# Altium project LimeSDR_Mini_1v0.PrjPcb (part 3 of 3)

## Sheet 09_Misc.SchDoc: Misc
size A3; Organization: Lime Microsystems; Address1: Surrey Tech Centre; Address2: Guildford GU2 7YG; Address3: Surrey; Address4: United Kingdom; Revision: v1.0; SheetNumber: 9; SheetTotal: 9
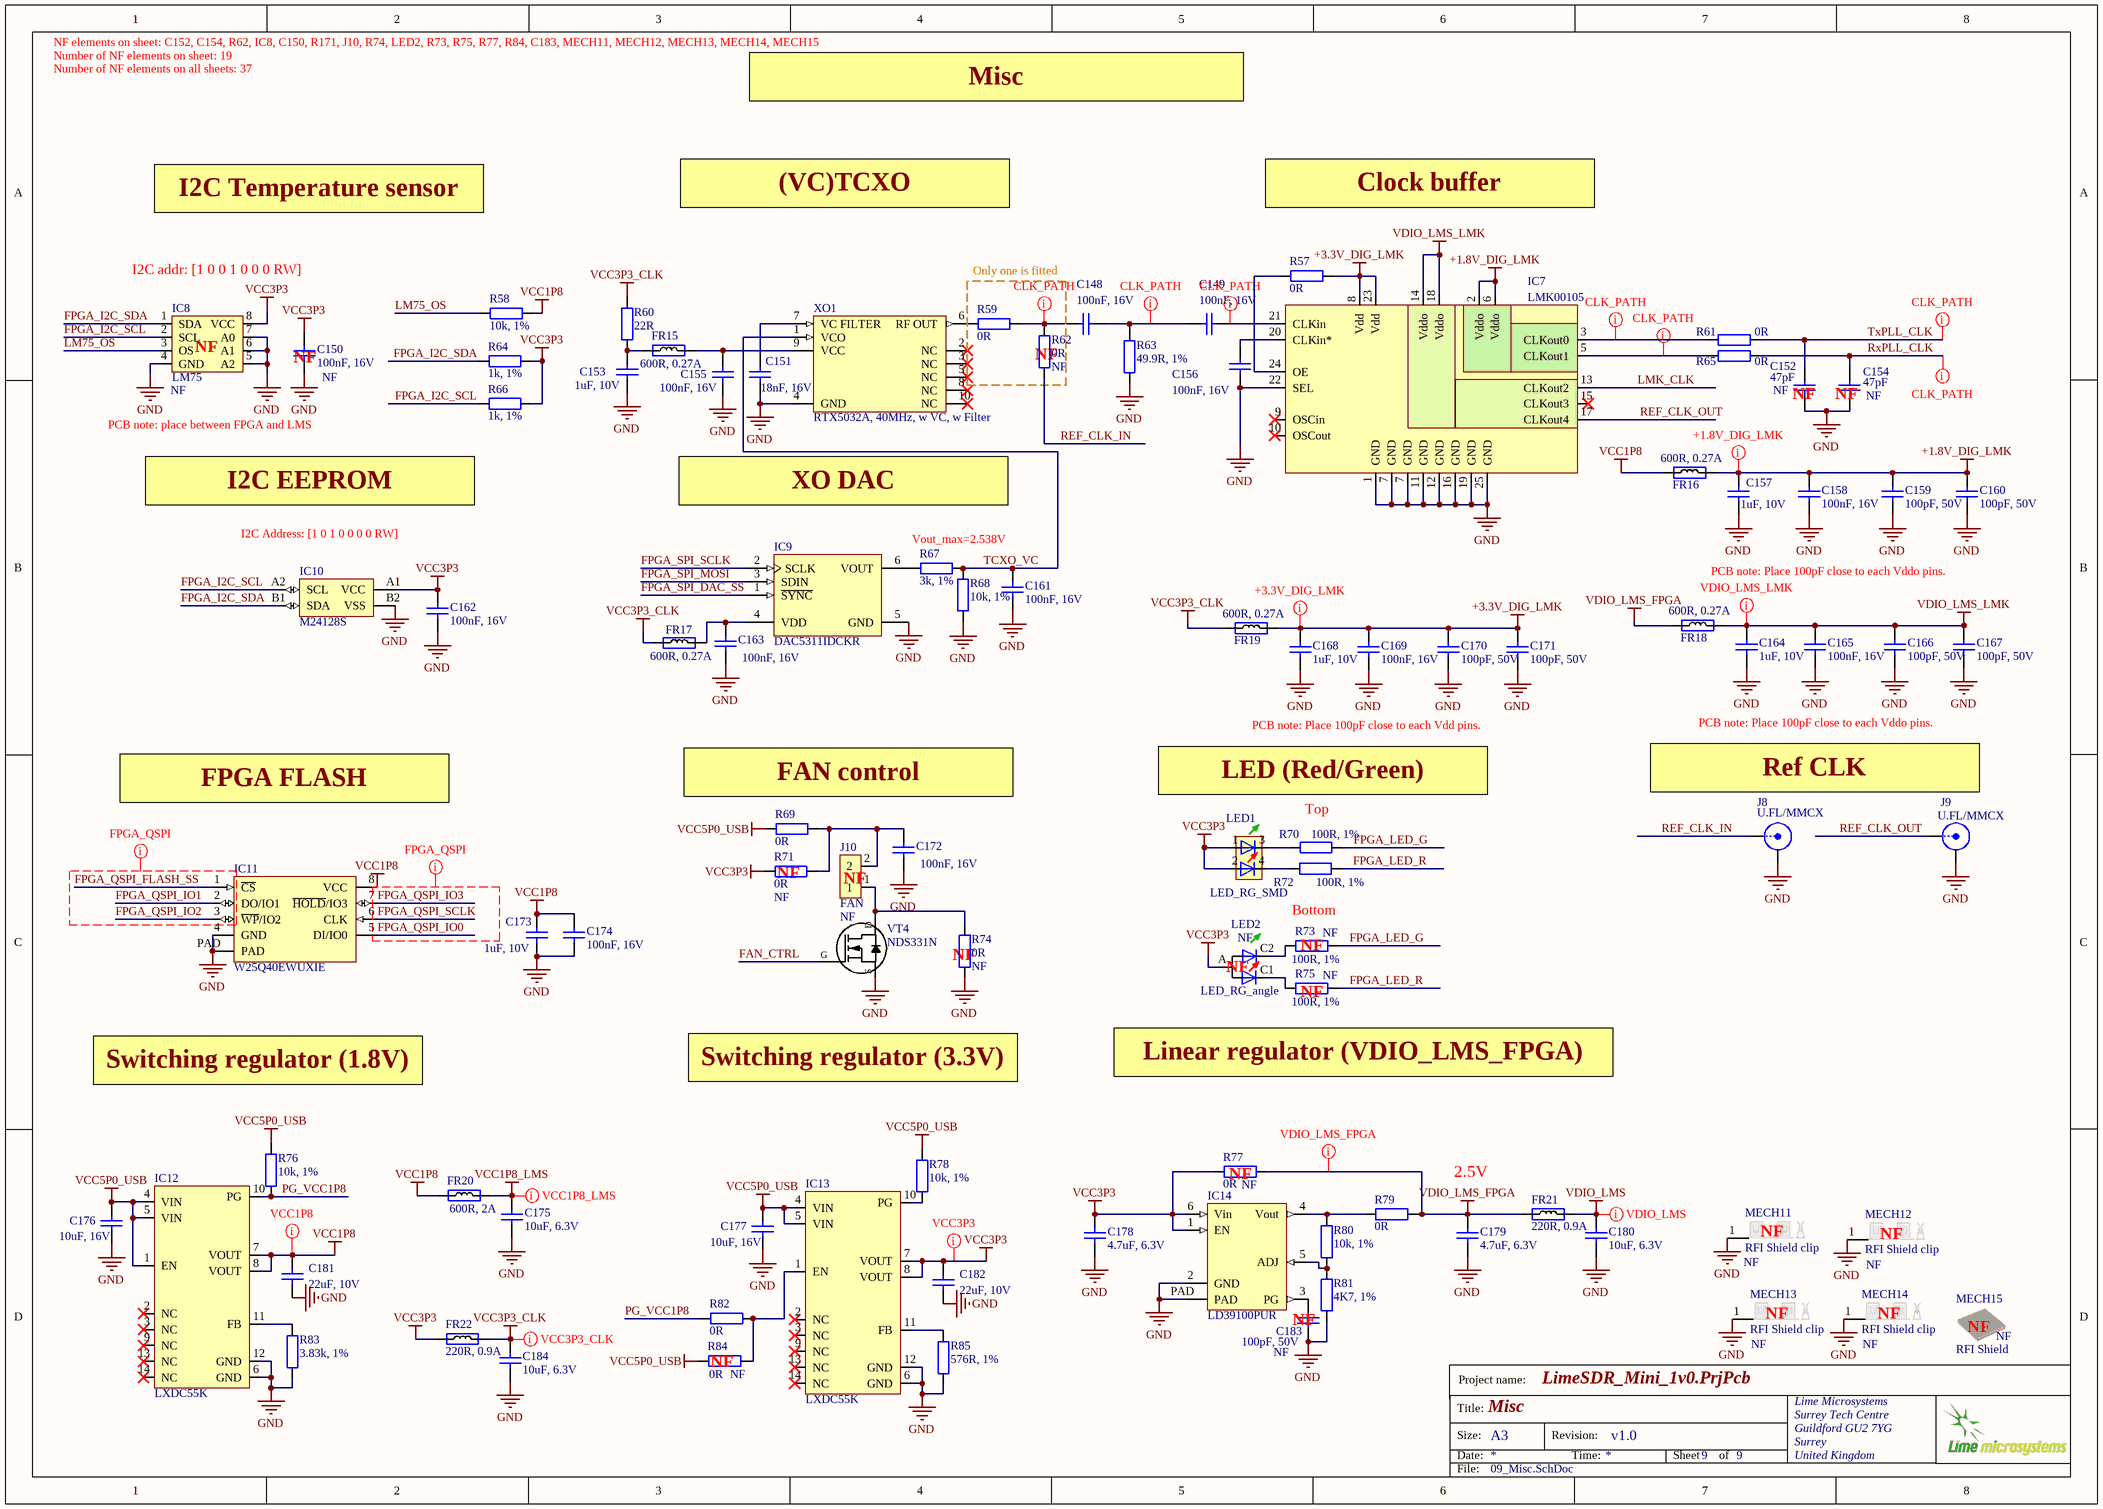
[diagram p6: 09_Misc.SchDoc]

### Parts
C148  100nF, 16V  [CAP0402]
C149  100nF, 16V  [CAP0402]
C150  100nF, 16V  Assembly Info: NF  [CAP0402]
C151  18nF, 16V  [CAP0402]
C152  47pF  Assembly Info: NF  [CAP0402]
C153  1uF, 10V  [CAP0402]
C154  47pF  Assembly Info: NF  [CAP0402]
C155  100nF, 16V  [CAP0402]
C156  100nF, 16V  [CAP0402]
C157  1uF, 10V  [CAP0402]
C158  100nF, 16V  [CAP0402]
C159  100pF, 50V  [CAP0402]
C160  100pF, 50V  [CAP0402]
C161  100nF, 16V  [CAP0402]
C162  100nF, 16V  [CAP0402]
C163  100nF, 16V  [CAP0402]
C164  1uF, 10V  [CAP0402]
C165  100nF, 16V  [CAP0402]
C166  100pF, 50V  [CAP0402]
C167  100pF, 50V  [CAP0402]
C168  1uF, 10V  [CAP0402]
C169  100nF, 16V  [CAP0402]
C170  100pF, 50V  [CAP0402]
C171  100pF, 50V  [CAP0402]
C172  100nF, 16V  [CAP0402]
C173  1uF, 10V  [CAP0402]
C174  100nF, 16V  [CAP0402]
C175  10uF, 6.3V  [CAP0603]
C176  10uF, 16V  [CAP0603]
C177  10uF, 16V  [CAP0603]
C178  4.7uF, 6.3V  [CAP0402]
C179  4.7uF, 6.3V  [CAP0402]
C180  10uF, 6.3V  [CAP0603]
C181  22uF, 10V  [CAP0603]
C182  22uF, 10V  [CAP0603]
C183  100pF, 50V  Assembly Info: NF  [CAP0402]
C184  10uF, 6.3V  [CAP0603]
FR15  600R, 0.27A  [RES0201]
FR16  600R, 0.27A  [RES0201]
FR17  600R, 0.27A  [RES0201]
FR18  600R, 0.27A  [RES0201]
FR19  600R, 0.27A  [RES0201]
FR20  600R, 2A  [RES0805]
FR21  220R, 0.9A  [RES0402]
FR22  220R, 0.9A  [RES0402]
IC7  LMK00105  [LMK00105SQ]
IC8  LM75  Assembly Info: NF  [HWSON8_LM75]
IC9  DAC5311IDCKR  [AD5601_SOT23-6]
IC10  M24128S  [M24128S]
IC11  W25Q40EWUXIE  [W25Q40EWUXIE_8-USON]
IC12  LXDC55K  [LXDC55K]
IC13  LXDC55K  [LXDC55K]
IC14  LD39100PUR  [LD39100PUR]
J8  U.FL/MMCX  [MMCX_UFL_conn_u]
J9  U.FL/MMCX  [MMCX_UFL_conn_u]
J10  FAN  Assembly Info: NF  [HDR_1x2_v2]
LED1  LED_RG_SMD  [LED-2x0603]
LED2  LED_RG_angle  Assembly Info: NF  [LED_RG_RIGHT_ANGLE_v2]
MECH11  RFI Shield clip  Assembly Info: NF  [RFI_SHIELD_CLPS_MINI]
MECH12  RFI Shield clip  Assembly Info: NF  [RFI_SHIELD_CLPS_MINI]
MECH13  RFI Shield clip  Assembly Info: NF  [RFI_SHIELD_CLPS_MINI]
MECH14  RFI Shield clip  Assembly Info: NF  [RFI_SHIELD_CLPS_MINI]
MECH15  RFI Shield  Assembly Info: NF  [WurthElectronic_RF_shield]
R57  0R  [RES0402]
R58  10k, 1%  [RES0402]
R59  0R  [RES0402]
R60  22R  [RES0402]
R61  0R  [RES0402]
R62  0R  Assembly Info: NF  [RES0402]
R63  49.9R, 1%  [RES0402]
R64  1k, 1%  [RES0402]
R65  0R  [RES0402]
R66  1k, 1%  [RES0402]
R67  3k, 1%  [RES0402]
R68  10k, 1%  [RES0402]
R69  0R  [RES0402]
R70  100R, 1%  [RES0402]
R71  0R  Assembly Info: NF  [RES0402]
R72  100R, 1%  [RES0402]
R73  100R, 1%  Assembly Info: NF  [RES0402]
R74  0R  Assembly Info: NF  [RES0402]
R75  100R, 1%  Assembly Info: NF  [RES0402]
R76  10k, 1%  [RES0402]
R77  0R  Assembly Info: NF  [RES0402]
R78  10k, 1%  [RES0402]
R79  0R  [RES0402]
R80  10k, 1%  [RES0402]
R81  4K7, 1%  [RES0402]
R82  0R  [RES0402]
R83  3.83k, 1%  [RES0402]
R84  0R  Assembly Info: NF  [RES0402]
R85  576R, 1%  [RES0402]
VT4  NDS331N  [SOT23-3]
XO1  RTX5032A, 40MHz, w VC, w Filter  [RAKON_RTX5032A]

### Blocks framed on the sheet
Only one is fitted: R59 R62

### Nets
+1.8V_DIG_LMK: C157.2 C158.2 C159.2 C160.2 FR16.2 IC7.2(Vddo) IC7.6(Vddo)
+3.3V_DIG_LMK: C168.2 C169.2 C170.2 C171.2 FR19.2 IC7.8(Vdd) IC7.23(Vdd) R57.2
GND: C150.2 C151.1 C152.1 C153.1 C154.1 C155.1 C156.1 C157.1 C158.1 C159.1 C160.1 C161.1 C162.2 C163.2 C164.1 C165.1 C166.1 C167.1 C168.1 C169.1 C170.1 C171.1 C172.2 C173.1 C174.2 C175.1 C176.1 C177.1 C178.1 C179.1 C180.1 C181.1 C182.1 C183.1 C184.1 IC7.1(GND) IC7.7(GND) IC7.11(GND) IC7.12(GND) IC7.16(GND) IC7.19(GND) IC7.22(SEL) IC7.25(GND) IC8.4(GND) IC8.5(A2) IC8.6(A1) IC8.7(A0) IC9.5(GND) IC10.B2(VSS) IC11.4(GND) IC11.PAD IC12.6(GND) IC12.12(GND) IC13.6(GND) IC13.12(GND) IC14.2(GND) IC14.PAD J8.2(Y) J9.2(Y) MECH11.1(GND) MECH12.1(GND) MECH13.1(GND) MECH14.1(GND) R63.1 R68.2 R74.1 R81.2 R83.1 R85.1 VT4.S XO1.4(GND)
VCC1P8: C173.2 C174.1 C181.2 FR16.1 FR20.1 IC11.8(VCC) IC12.7(VOUT) IC12.8(VOUT) R58.2
VCC1P8_LMS: C175.2 FR20.2
VCC3P3: C150.1 C162.1 C178.2 C182.2 FR22.1 IC8.8(VCC) IC10.A1(VCC) IC13.7(VOUT) IC13.8(VOUT) IC14.1(EN) IC14.6(Vin) LED1.1 LED1.2 LED2.A R64.1 R66.1 R71.1 R77.1
VCC3P3_CLK: C184.2 FR17.1 FR19.1 FR22.2 R60.2
VCC5P0_USB: C176.2 C177.2 IC12.1(EN) IC12.4(VIN) IC12.5(VIN) IC13.4(VIN) IC13.5(VIN) R69.1 R76.2 R78.2 R84.1
VDIO_LMS: C180.2 FR21.2
VDIO_LMS_FPGA: C179.2 FR18.1 FR21.1 R77.2 R79.2
VDIO_LMS_LMK: C164.2 C165.2 C166.2 C167.2 FR18.2 IC7.14(Vddo) IC7.18(Vddo)
FAN_CTRL: VT4.G
FPGA_I2C_SCL: IC8.2(SCL) IC10.A2(SCL) R66.2
FPGA_I2C_SDA: IC8.1(SDA) IC10.B1(SDA) R64.2
FPGA_LED_G: R70.2 R73.2
FPGA_LED_R: R72.2 R75.2
FPGA_QSPI_FLASH_SS: IC11.1(~{CS})
FPGA_QSPI_IO0: IC11.5(DI/IO0)
FPGA_QSPI_IO1: IC11.2(DO/IO1)
FPGA_QSPI_IO2: IC11.3(~{WP}/IO2)
FPGA_QSPI_IO3: IC11.7(~{HOLD}/IO3)
FPGA_QSPI_SCLK: IC11.6(CLK)
FPGA_SPI_DAC_SS: IC9.1(~{SYNC})
FPGA_SPI_MOSI: IC9.3(SDIN)
FPGA_SPI_SCLK: IC9.2(SCLK)
LM75_OS: IC8.3(OS) R58.1
LMK_CLK: IC7.13(CLKout2)
PG_VCC1P8: IC12.10(PG) R76.1 R82.2
REF_CLK_IN: J8.1(X) R62.1
REF_CLK_OUT: IC7.17(CLKout4) J9.1(X)
RxPLL_CLK: C154.2 R65.1
TCXO_VC: C161.2 R67.1 R68.1 XO1.1(VCO)
TxPLL_CLK: C152.2 R61.1
NetC148_1: C148.1 C149.2 R63.2
NetC148_2: C148.2 R59.2 R62.2
NetC149_1: C149.1 IC7.21(CLKin)
NetC151_2: C151.2 XO1.7(VC_FILTER)
NetC153_2: C153.2 FR15.1 R60.1
NetC155_2: C155.2 FR15.2 XO1.9(VCC)
NetC156_2: C156.2 IC7.20(CLKin*)
NetC163_1: C163.1 FR17.2 IC9.4(VDD)
NetC172_1: C172.1 J10.2 R69.2 R71.2
NetC183_2: C183.2 IC14.3(PG)
NetIC7_3: IC7.3(CLKout0) R61.2
NetIC7_5: IC7.5(CLKout1) R65.2
NetIC7_24: IC7.24(OE) R57.1
NetIC9_6: IC9.6(VOUT) R67.2
NetIC12_11: IC12.11(FB) R83.2
NetIC13_1: IC13.1(EN) R82.1 R84.2
NetIC13_10: IC13.10(PG) R78.1
NetIC13_11: IC13.11(FB) R85.2
NetIC14_4: IC14.4(Vout) R79.1 R80.2
NetIC14_5: IC14.5(ADJ) R80.1 R81.1
NetJ10_1: J10.1 R74.2 VT4.D
NetLED1_3: LED1.3 R70.1
NetLED1_4: LED1.4 R72.1
NetLED2_C1: LED2.C1 R75.1
NetLED2_C2: LED2.C2 R73.1
NetR59_1: R59.1 XO1.6(RF_OUT)

Not connected (* = marked no-connect by the designer): IC7 9(OSCin)* 10(OSCout)* 15(CLKout3)*; IC12 2(NC)* 3(NC)* 9(NC)* 13(NC)* 14(NC)*; IC13 2(NC)* 3(NC)* 9(NC)* 13(NC)* 14(NC)*; XO1 2(NC)* 3(NC)* 5(NC)* 8(NC)* 10(NC)*

### Layout directives
net class CLK_PATH: NetC148_1, NetC148_2, NetC149_1, NetIC7_3, NetIC7_5, RxPLL_CLK, TxPLL_CLK
net class +1.8V_DIG_LMK: +1.8V_DIG_LMK
net class VCC1P8: (no net found under the mark)
net class VCC3P3: VCC3P3
net class FPGA_QSPI: FPGA_QSPI_FLASH_SS, FPGA_QSPI_IO0, FPGA_QSPI_IO1, FPGA_QSPI_IO2, FPGA_QSPI_IO3, FPGA_QSPI_SCLK, VCC1P8
net class VDIO_LMS_LMK: VDIO_LMS_LMK
net class +3.3V_DIG_LMK: +3.3V_DIG_LMK
net class VDIO_LMS_FPGA: VDIO_LMS_FPGA
net class VCC3P3_CLK: VCC3P3_CLK
net class VCC1P8_LMS: VCC1P8_LMS
net class VDIO_LMS: VDIO_LMS

### Notes on the sheet
- NF elements on sheet: C152, C154, R62, IC8, C150, R171, J10, R74, LED2, R73, R75, R77, R84, C183, MECH11, MECH12, MECH13, MECH14, MECH15
- Number of NF elements on sheet: 19
- Number of NF elements on all sheets: 37
- Misc
- I2C Temperature sensor
- (VC)TCXO
- Clock buffer
- I2C addr: [1 0 0 1 0 0 0 RW]
- (near IC8) NF
- (near C150) NF
- (near R62) NF
- PCB note: place between FPGA and LMS
- (near C152) NF
- (near C154) NF
- I2C EEPROM
- XO DAC
- I2C Address: [1 0 1 0 0 0 0 RW]
- Vout_max=2.538V
- PCB note: Place 100pF close to each Vddo pins.
- LED (Red/Green)
- PCB note: Place 100pF close to each Vdd pins.
- Ref CLK
- FPGA FLASH
- FAN control
- (near R70) Top
- (near R71) NF
- (near J10) NF
- Bottom
- (near R74) NF
- (near LED2) NF
- (near R73) NF
- (near R75) NF
- Switching regulator (1.8V)
- Switching regulator (3.3V)
- Linear regulator (VDIO_LMS_FPGA)
- (near R77) NF
- 2.5V
- (near MECH11) NF
- (near MECH12) NF
- NF
- (near MECH13) NF
- (near MECH14) NF
- (near R84) NF
- (near MECH15) NF
- Project name:
- Title:
- Size:
- Date:
- A3
- Revision:
- Time:
- Sheet
- of
- File:

### Library data of the parts
C148 C149 C155 C156 C158 C161 C165 C169 = Cap_0402: Manufacturer: Murata Electronics; Manufacturer Part Number: GRM155R71C104KA88D; Part Description: 0.10µF ±10% 16V X7R Ceramic Capacitor -55°C ~ 125°C Surface Mount, MLCC 0402 (1005 Metric) 0.039" L x 0.020" W (1.00mm x 0.50mm); Tolerance: 10 %; Type: General Purpose MLCC; Capacitance: 0.1 uF; Case Length: 1 mm; Dielectric: X7R; Case Height: 0.5 mm; Temperature Coefficient / Code: +/- 15 %; Value: 100nF, 16V; Supplier 1: Mouser; Supplier Part Number 1: 81-GRM155R71C104KA88; Case Code - in: 0402; RoHS: RoHS Compliant; Operating Temperature Range: - 55 C to + 125 C; Series: GRM; Termination Style: SMD/SMT; Package / Case: 0402 (1005 metric); Voltage Rating DC: 16 V; Maximum Operating Temperature: + 125 C; Case Code - mm: 1005; Minimum Operating Temperature: - 55 C; Product Category: Low & Medium Capacitance SMD Ceramic Chip Capacitors; Packaging: Reel; Product: General Type MLCCs; Category: Multilayer Ceramic Capacitors MLCC - SMD/SMT; Brand: Murata Electronics; Case Width: 0.5 mm; RoHS - Mouser: Y; Standard Pack Qty: 10000; Minimum Order Quantity: 1; Reeling: True; Manufacturer Part Number 1: GRM155R71C104KA88D
C150 C162 C163 C172 C174 = Cap_0603: Manufacturer Part Number 1: GRM155R71C104KA88D; Part Description: 0.10µF ±10% 16V X7R Ceramic Capacitor -55°C ~ 125°C Surface Mount, MLCC 0402 (1005 Metric) 0.039" L x 0.020" W (1.00mm x 0.50mm); Brand: Murata Electronics; Tolerance: 10 %; Type: General Purpose MLCC; Capacitance: 0.1 uF; Temperature Coefficient / Code: +/- 15 %; Case Height: 0.5 mm; Case Length: 1 mm; Dielectric: X7R; Supplier 1: Mouser; Supplier Part Number 1: 81-GRM155R71C104KA88; Case Code - in: 0402; Manufacturer: Murata Electronics; Category: Multilayer Ceramic Capacitors MLCC - SMD/SMT; Voltage Rating DC: 16 V; Value: 100nF, 16V; Manufacturer Part Number: GRM155R71C104KA88D; Case Code - mm: 1005; Case Width: 0.5 mm; Maximum Operating Temperature: + 125 C; Minimum Operating Temperature: - 55 C; Minimum Order Quantity: 1; Operating Temperature Range: - 55 C to + 125 C; Package / Case: 0402 (1005 metric); Packaging: Reel; Product: General Type MLCCs; Product Category: Low & Medium Capacitance SMD Ceramic Chip Capacitors; Reeling: True; RoHS - Mouser: Y; RoHS: RoHS Compliant; Series: GRM; Standard Pack Qty: 10000; Termination Style: SMD/SMT
C151 = Cap_0402: Manufacturer: Yageo; Manufacturer Part Number 1: CC0402KRX7R7BB183; Part Description: CAP CER 0.018UF 16V X7R 0402; Temperature Coefficient: X7R; Capacitance: 0.018µF; Tolerance: ±10%; Value: 18nF, 16V; Supplier 1: Digi-Key; Supplier Part Number 1: 311-1706-1-ND; Part Status: Active; Category: Capacitors; Packaging: Cut Tape (CT); Voltage - Rated: 16V; RoHS: RoHS Compliant; Size / Dimension: 0.039" L x 0.020" W (1.00mm x 0.50mm); Package / Case: 0402 (1005 Metric); Mounting Type: Surface Mount, MLCC; Thickness (Max): 0.022" (0.55mm); Applications: General Purpose; Operating Temperature: -55°C ~ 125°C
C152 C154 = Cap_0402: Manufacturer Part Number 1: C1005C0G1H470F050BA; Manufacturer: TDK Corporation; Part Description: 47pF ±1% 50V C0G, NP0 Ceramic Capacitor -55°C ~ 125°C Surface Mount, MLCC 0402 (1005 Metric) 0.039" L x 0.020" W (1.00mm x 0.50mm); Voltage - Rated: 50V; Temperature Coefficient: C0G, NP0; Tolerance: ±1%; Value: 47pF; Supplier 1: Digi-Key; Supplier Part Number 1: 445-5361-1-ND; Package / Case: 0402 (1005 Metric); Lead Spacing: -; Ratings: -; Mounting Type: Surface Mount, MLCC; Operating Temperature: -55°C ~ 125°C; Thickness (Max): 0.022" (0.55mm); Capacitance: 47pF; Packaging: Cut Tape (CT); Features: -; Applications: General Purpose; Lead Style: -; Size / Dimension: 0.039" L x 0.020" W (1.00mm x 0.50mm); Height - Seated (Max): -; RoHS: RoHS Compliant; Category: Capacitors
C153 C157 C164 C168 C173 = Cap_0402: Manufacturer Part Number 1: GRM155R61A105KE15J; Manufacturer: TDK; Part Description: 1µF ±10% 10V X5R Ceramic Capacitor -55°C ~ 85°C Surface Mount, MLCC 0402 (1005 Metric) 0.039" L x 0.020" W (1.00mm x 0.50mm); Voltage Rating: 10; Capacitance Tolerance: ± 10%; Product Range: TDK - C Series; Ceramic Capacitor Case: 0402 [1005 Metric]; Capacitance: 1; Dielectric Characteristic: X6; Value: 1uF, 10V; Supplier 1: Newark; Supplier Part Number 1: 490-6298-2-ND; MSL: -; RoHS: YES
C159 C160 C166 C167 C170 C171 C183 = Cap_0402: Manufacturer Part Number 1: CC0402JRNPO9BN101; Manufacturer: Yageo; Part Description: 100pF ±5% 50V C0G, NP0 Ceramic Capacitor -55°C ~ 125°C Surface Mount, MLCC 0402 (1005 Metric) 0.039" L x 0.020" W (1.00mm x 0.50mm); Temperature Coefficient: C0G, NP0; Tolerance: ±5%; Value: 100pF, 50V; Supplier 1: Digi-Key; Supplier Part Number 1: 311-1024-1-ND; RoHS: RoHS Compliant; Category: Capacitors; Applications: General Purpose; Mounting Type: Surface Mount, MLCC; Capacitance: 100pF; Ratings: -; Packaging: Cut Tape (CT); Voltage - Rated: 50V; Size / Dimension: 0.039" L x 0.020" W (1.00mm x 0.50mm); Height - Seated (Max): -; Package / Case: 0402 (1005 Metric); Operating Temperature: -55°C ~ 125°C; Features: -; Lead Spacing: -; Lead Style: -; Thickness (Max): 0.022" (0.55mm)
C175 C180 C184 = Cap_0603: Manufacturer Part Number 1: CC0603MRX5R5BB106; Manufacturer: Yageo; Part Description: 10µF ±20% 6.3V X5R Ceramic Capacitor -55°C ~ 85°C Surface Mount, MLCC 0603 (1608 Metric) 0.063" L x 0.031" W (1.60mm x 0.80mm); Capacitance: 10µF; Tolerance: ±20%; Supplier 1: Digi-Key; Supplier Part Number 1: 311-1448-2-ND; Package / Case: 0603 (1608 Metric); Category: Capacitors; Voltage - Rated: 6.3V; Value: 10uF, 6.3V
C176 C177 = Cap_0603: Manufacturer: Yageo; Manufacturer Part Number 1: GRM188R61C106MA73D; Part Description: 10µF ±20% 16V X5R Ceramic Capacitor -55°C ~ 85°C Surface Mount, MLCC 0603 (1608 Metric) 0.063" L x 0.031" W (1.60mm x 0.80mm); Temperature Coefficient: X5R; Capacitance: 10µF; Tolerance: ±20%; Value: 10uF, 16V; Supplier 1: Digi-Key; Supplier Part Number 1: 490-7201-2-ND; Category: Capacitors; Ratings: -; Features: -; Lead Style: -; Package / Case: 0603 (1608 Metric); Lead Spacing: -; Applications: General Purpose; Voltage - Rated: 16V; Operating Temperature: -55°C ~ 85°C; Thickness (Max): 0.039" (1.00mm); Mounting Type: Surface Mount, MLCC; RoHS: RoHS Compliant; Size / Dimension: 0.063" L x 0.031" W (1.60mm x 0.80mm); Packaging: Tape & Reel (TR); Height - Seated (Max): -
C178 C179 = Cap_0402: Manufacturer: Murata Electronics North America; Manufacturer Part Number: GRM155R60J475ME87D; Part Description: 4.7µF ±20% 6.3V X5R Ceramic Capacitor -55°C ~ 85°C Surface Mount, MLCC 0402 (1005 Metric) 0.039" L x 0.020" W (1.00mm x 0.50mm); Tolerance: ±20%; Capacitance: 4.7µF; Temperature Coefficient: X5R; Lead Style: -; Ratings: -; Height - Seated (Max): -; Thickness (Max): 0.022" (0.55mm); Voltage - Rated: 6.3V; Packaging: Cut Tape (CT); Lead Spacing: -; Category: Capacitors; Supplier Part Number 1: 490-5408-1-ND; Applications: General Purpose; Operating Temperature: -55°C ~ 85°C; Mounting Type: Surface Mount, MLCC; Features: Derating Recommended; RoHS: RoHS Compliant; Supplier 1: Digi-Key; Package / Case: 0402 (1005 Metric); Size / Dimension: 0.039" L x 0.020" W (1.00mm x 0.50mm); Value: 4.7uF, 6.3V
C181 C182 = Cap_0603: Manufacturer Part Number 1: C1608X5R1A226M080AC; Manufacturer: TDK Corporation; Part Description: 22µF ±20% 10V X5R Ceramic Capacitor -55°C ~ 85°C Surface Mount, MLCC 0603 (1608 Metric) 0.063" L x 0.031" W (1.60mm x 0.80mm); Brand: TDK; Temperature Coefficient / Code: +/- 15 %; Tolerance: 20 %; Type: Multilayer Ceramic Chip Capacitor; Supplier 1: Mouser; Supplier Part Number 1: 810-C1608X5R1A226M; Package / Case: 0603 (1608 metric); Category: Multilayer Ceramic Capacitors MLCC - SMD/SMT; Capacitance: 22 uF; Operating Temperature Range: - 55 C to + 85 C; Case Code - in: 0603; Voltage Rating DC: 10 V; Case Code - mm: 1608; Value: 22uF, 10V
FR15-FR19 = Ferrite: Manufacturer Part Number 1: BK0603TS601-T; Manufacturer: Taiyo Yuden; Part Description: FERRITE BEAD 600 OHM 0201 1LN; DC Resistance (DCR): 750 mOhm Max; Filter Type: Differential Mode - Single; Impedance @ Frequency: 600 Ohm @ 100MHz; Current Rating: 270mA; Value: 600R@100MHz; Supplier 1: Digi-Key; Supplier Part Number 1: 587-3277-1-ND; Size / Dimension: 0.024" L x 0.012" W (0.60mm x 0.30mm); Package / Case: 0201 (0603 Metric); Height (Max): 0.013" (0.33mm); Mounting Type: Surface Mount; Packaging: Cut Tape (CT); RoHS: RoHS Compliant; Category: Filters
FR20 = Ferrite: Manufacturer Part Number 1: MPZ2012S601AT000; Manufacturer: TDK Corporation; Part Description: FERRITE BEAD 600 OHM 0805 1LN; Filter Type: Differential Mode - Single; Impedance @ Frequency: 600 Ohm @ 100MHz; DC Resistance (DCR): 100 mOhm Max; Supplier 1: Digi-Key; Supplier Part Number 1: 445-2206-2-ND; Mounting Type: Surface Mount; RoHS: RoHS Compliant; Height (Max): 0.041" (1.05mm); Packaging: Tape & Reel (TR); Category: Filters; Current Rating: 2A; Package / Case: 0805 (2012 Metric); Size / Dimension: 0.079" L x 0.049" W (2.00mm x 1.25mm)
FR21 FR22 = Ferrite: Manufacturer: TDK Corporation; Manufacturer Part Number 1: MPZ1005S221ET000; Part Description: FERRITE BEAD 220 OHM 0402 1LN; Impedance @ Frequency: 220 Ohm @ 100MHz; Current Rating: 900mA; DC Resistance (DCR): 220 mOhm Max; Supplier 1: Digi-Key; Package / Case: 0402 (1005 Metric); Category: Filters; Supplier Part Number 1: 445-9329-2-ND; Value: 220R, 0.9A
IC7 = LMK00105: Manufacturer: Texas Instruments; Manufacturer Part Number 1: LMK00105SQ/NOPB; Part Description: IC CLK BUFFER 2:5 200MHZ 24WQFN; Frequency - Max: 200MHz; Voltage - Supply: 2.375 V ~ 3.45 V; Input: HCSL, LVCMOS, LVDS, LVPECL, LVTTL, SSTL, Crystal; Differential - Input:Output: Yes/No; Supplier 1: Digi-Key; Type: Fanout Buffer (Distribution), Multiplexer, Translator; Category: Integrated Circuits (ICs); Operating Temperature: -40°C ~ 85°C; Package / Case: 24-WFQFN Exposed Pad; Supplier Device Package: 24-WQFN (4x4); Supplier Part Number 1: LMK00105SQ/NOPBCT-ND
IC8 = LM75: Manufacturer: NXP Semiconductors; Manufacturer Part Number: LM75BTP,147; Part Description: SENSOR TEMPERATURE I2C 8HWSON; Sensing Temperature - Local: -55°C ~ 125°C; Output Type: I²C; Accuracy - Highest (Lowest): ±2°C (±3°C); Voltage - Supply: 2.8 V ~ 5.5 V; Test Condition: -25°C ~ 100°C (-55°C ~ 125°C); Sensor Type: Digital, Local; Resolution: 10 b; Supplier 1: Digi-Key; Operating Temperature: -55°C ~ 125°C; Features: Output Switch, Programmable Limit, Shutdown Mode; Supplier Device Package: 8-HWSON (2x3); Sensing Temperature - Remote: -; Category: Sensors, Transducers; Packaging: Tape & Reel (TR); RoHS: RoHS Compliant; Package / Case: 8-WFDFN Exposed Pad; Supplier Part Number 1: 568-9815-2-ND
IC9 = AD5601BKSZ-REEL7: Single 8-Bit nanoDAC with SPI Interface in LFCSP and SC70, 2.7 to 5.5 V, <100 uA, -40 to +125 degC, KS-6, Pb-Free, Reel; Part Description: 8 Bit Digital to Analog Converter 1 SC-70-6; Manufacturer: Texas Instruments; Number of Bits: 8; Number of D/A Converters: 1; Settling Time: 12µs (Typ); Output Type: Voltage - Buffered; Differential Output: No; Data Interface: SPI, DSP; Reference Type: Supply; Voltage - Supply, Analog: 2 V ~ 5.5 V; INL/DNL (LSB): ±0.01, ±0.01; Architecture: String DAC; Supplier 1: Digi-Key; Supplier Part Number 1: 296-24180-1-ND; Manufacturer Part Number: DAC5311IDCKR; RoHS: RoHS Compliant; Category: Integrated Circuits (ICs); Stock 1: 12227; Pricing 1: 1=1.53, 10=1.367, 100=1.0661, 500=0.88066, 1000=0.69525 (USD); Packaging: Cut Tape (CT); Part Status: Active; Voltage - Supply, Digital: 2 V ~ 5.5 V; Operating Temperature: -40°C ~ 125°C; Package / Case: 6-TSSOP, SC-88, SOT-363; Supplier Device Package: SC-70-6; ComponentLink1URL: http://www.ti.com/lit/ds/symlink/dac5311.pdf; ComponentLink1Description: http://www.ti.com/lit/ds/symlink/dac5311.pdf
IC10 = M24128S: Manufacturer: STMicroelectronics; Manufacturer Part Number 1: M24128S-FCU6T/T; Part Description: IC EEPROM 128KBIT 400KHZ 4WLCSP; Organization: 16 k x 8; Format - Memory: EEPROMs - Serial; Memory Type: EEPROM; Memory Size: 128K (16K x 8); Speed: 400kHz; Interface: I²C, 2-Wire Serial; Voltage - Supply: 1.7 V ~ 5.5 V; Supplier 1: Digi-Key; RoHS: RoHS Compliant; Category: Integrated Circuits (ICs); Stock 1: 1555; Pricing 1: 1=0.48, 10=0.473, 100=0.3883, 500=0.37752, 1000=0.3674 (USD); Packaging: Cut Tape (CT); Part Status: Active; Operating Temperature: -40°C ~ 85°C (TA); Package / Case: 4-XFBGA, WLCSP; Supplier Device Package: 4-WLCSP; ComponentLink1URL: http://www.st.com/content/ccc/resource/technical/document/datasheet/54/55/87/98/35/27/49/88/DM00103408.pdf/files/DM00103408.pdf/jcr:content/translations/en.DM00103408.pdf; ComponentLink1Description: http://www.st.com/content/ccc/resource/technical/document/datasheet/54/55/87/98/35/27/49/88/DM00103408.pdf/files/DM00103408.pdf/jcr:content/translations/en.DM00103408.pdf; Supplier Part Number 1: 497-15026-1-ND
IC11 = W25Q40EWUXIE: Manufacturer: Winbond Electronics; Manufacturer Part Number 1: W25Q40EWUXIE TR; Part Description: FLASH - NOR Memory IC 4Mb (512K x 8) SPI 8-USON (2x3); Memory Type: Non-Volatile; Memory Format: FLASH; Memory Size: 4Mb (512K x 8); Write Cycle Time - Word, Page: 800µs; Memory Interface: SPI; Voltage - Supply: 1.65 V ~ 1.95 V; Supplier 1: Digi-Key; RoHS: RoHS Compliant; Category: Integrated Circuits (ICs); Stock 1: 4000; Pricing 1: 1=0.75 (USD); Packaging: Cut Tape (CT); Part Status: Active; Technology: FLASH - NOR; Access Time: -; Operating Temperature: -40°C ~ 85°C (TA); Mounting Type: Surface Mount; Package / Case: 8-UFDFN Exposed Pad; Supplier Device Package: 8-USON (2x3); ComponentLink1URL: https://www.winbond.com/resource-files/w25q40ew%20revf%2011252015%20sfdp.pdf; ComponentLink1Description: https://www.winbond.com/resource-files/w25q40ew%20revf%2011252015%20sfdp.pdf; Supplier Part Number 1: W25Q40EWUXIE CT-ND
IC12 IC13 = LXDC55K: LXDC55KAAA-205; Manufacturer: Murata Electronics North America; Power (Watts) - Manufacture Series: 11W; Part Description: DC/DC CONVERTER 3.6V 3A SMD; Current - Output (Max): 3A; Efficiency: 93%; Voltage - Input (Min): 2.7V; Voltage - Input (Max): 5.5V; Voltage - Output 1: 0.8 ~ 3.6 V; Number of Outputs: 1; Supplier 1: Digi-Key; Manufacturer Part Number 1: LXDC55KAAA-205; Category: Power Supplies - Board Mount; Type: Non-Isolated PoL Module; Package / Case: 14-SMD Module; Voltage - Output 3: -; Mounting Type: Surface Mount; Applications: ITE (Commercial); RoHS: RoHS Compliant; Power (Watts) - Max: 11W; Voltage - Output 2: -; Features: OCP, OTP, UVLO; Operating Temperature: -40°C ~ 85°C; Packaging: Digi-Reel®; Voltage - Isolation: -; Size / Dimension: 0.224" L x 0.224" W x 0.079" H (5.70mm x 5.70mm x 2.00mm); Supplier Part Number 1: 490-7312-6-ND
IC14 = LD39100PUR: Manufacturer: STMicroelectronics; Part Description: Linear Voltage Regulator IC Positive Adjustable Output 0.8 V ~ 4.5 V 1A 6-DFN (3x3); Output Configuration: Positive; Output Type: Adjustable; Voltage - Input (Max): 5.5V; Voltage - Output (Min/Fixed): 0.8V; Voltage - Output (Max): 4.6V; Voltage Dropout (Max): 0.4V @ 1A; Current - Output: 1A; Current - Supply: 50µA ~ 300µA; PSRR: 70dB ~ 65dB (1kHz ~ 10kHz); Control Features: Enable, Power Good; Protection Features: Over Current, Over Temperature, Short Circuit; Supplier 1: Digi-Key; Manufacturer Part Number 1: LD39100PUR; RoHS: RoHS Compliant; Category: Integrated Circuits (ICs); Stock 1: 27970; Pricing 1: 1=0.85, 10=0.76, 100=0.5923, 500=0.48926, 1000=0.38625 (USD); Packaging: Cut Tape (CT); Part Status: Active; Operating Temperature: -40°C ~ 125°C; Mounting Type: Surface Mount; Package / Case: 6-VDFN Exposed Pad; Supplier Device Package: 6-DFN (3x3); ComponentLink1URL: http://www.st.com/content/ccc/resource/technical/document/datasheet/72/02/e5/ee/df/36/40/5e/CD00233788.pdf/files/CD00233788.pdf/jcr:content/translations/en.CD00233788.pdf; ComponentLink1Description: http://www.st.com/content/ccc/resource/technical/document/datasheet/72/02/e5/ee/df/36/40/5e/CD00233788.pdf/files/CD00233788.pdf/jcr:content/translations/en.CD00233788.pdf; Supplier Part Number 1: 497-11013-1-ND
J8 J9 = RF_IF_connector: CONN UMC RCPT STR 50 OHM SMD; Manufacturer: Molex, LLC; Manufacturer Part Number 1: 0734120110; Part Description: Ultra Miniature Coaxial Connector Receptacle, Male Pin 50 Ohm Surface Mount Solder; Body Finish: Nickel; Body Material: Phosphor Bronze; Center Contact Material: Brass; Center Contact Plating: Gold; Connector Style: Ultra Miniature Coaxial; Connector Type: Jack, Male Pin; Contact Termination: Solder; Dielectric Material: Liquid Crystal Polymer (LCP); Frequency - Max: 6GHz; Impedance: 50 Ohm; Voltage Rating: 60V; Cable Group: -; Category: Connectors, Interconnects; Fastening Type: Snap-On; Features: -; Housing Color: Silver; Ingress Protection: -; Mounting Type: Surface Mount; Operating Temperature: -40°C ~ 90°C; Packaging: Cut Tape (CT); RoHS: RoHS Compliant; Shield Termination: Solder; Supplier 1: Digi-Key; Supplier Part Number 1: WM5587CT-ND
J10 = Jumper: Manufacturer Part Number 1: 961102-6404-AR; Part Description: 2 Positions Header, Unshrouded Connector 0.100" (2.54mm) Through Hole Gold; Manufacturer: 3M; Connector Type: Header, Unshrouded; Supplier 1: Digi-Key; Supplier Part Number 1: 3M9447-ND; Contact Type: Male Pin; Color: Black; Mounting Type: Through Hole; Category: Connectors, Interconnects; Contact Finish: Gold
LED1 = LED_green_red_SMD: Manufacturer Part Number 1: HSMF-C165; Manufacturer: Avago Technologies US Inc.; Part Description: LED GREEN/RED DIFFUSED 0603 SMD; Millicandela Rating: 15mcd Green, 10mcd Red; Lens Transparency: Diffused; Lens Color: White; Lens Style/Size: Rectangle with Flat Top, 1.60mm x 0.80mm; Wavelength - Peak: 570nm Green, 636nm Red; Wavelength - Dominant: 572nm Green, 621nm Red; Viewing Angle: 120°; Voltage - Forward (Vf) (Typ): 2.2V Green, 1.95V Red; Current - Test: 20mA; Color: Green, Red; Supplier 1: Digi-Key; Height (Max): 0.50mm; Packaging: Cut Tape (CT); Category: Optoelectronics; Mounting Type: Surface Mount; Package / Case: 0603 (1608 Metric); Size / Dimension: 1.60mm L x 0.80mm W; Supplier Device Package: *; RoHS: RoHS Compliant; Supplier Part Number 1: 516-1419-1-ND
LED2 = LED_green_red_right_angle: 160-2033-1-ND; Manufacturer Part Number 1: LTST-S326KGJRKT; Part Description: LED GREEN/RED CLEAR 2SMD R/A; Viewing Angle: 130 deg; Brand: Lite-On; Illumination Color: Red, Green; If - Forward Current: 20 mA; Luminous Intensity: 45 mcd, 35 mcd; LED Size: 3 mm x 2 mm x 1 mm; Lens Color/Style: Water Clear; Vf - Forward Voltage: 2 V, 2 V; Wavelength/Color Temperature: 631 nm, 571 nm; Supplier 1: Mouser; Category: Standard LEDs - SMD; Minimum Order Quantity: 1; Minimum Operating Temperature: - 55 C; Packaging: Reel; RoHS: RoHS Compliant; Mounting Style: SMD/SMT; Standard Pack Qty: 3000; Package / Case: Side Looker; Orientation: Side View; Maximum Operating Temperature: + 85 C; Reeling: True; RoHS - Mouser: Y; Product Category: SMT LED; Manufacturer: Lite-On; Supplier Part Number 1: 859-LTST-S326KGJRKT
MECH11-MECH14 = RFI_SHIELD_CLIP: Manufacturer: HARWIN; Part Description: RFI SHIELD CLIP MINI TIN SMD; Manufacturer Part Number 1: S0971-46R; SVHC: No SVHC (15-Jun-2015); Supplier 1: Farnell; Supplier: Farnell; Length: 5.8; Clip Type: RFI Shield Clip; Clip Diameter: -; Product Range: -; Mounting Hole Dia: -; RoHS: YES; Supplier Part Number 1: 2361677
MECH15 = RFI_SHIELD_1: Part Description: Enclosure, Shielding Cabinet Cover, Shielding Cabinet, 25 mm, 25 mm, 3 mm, Tin Plate; Manufacturer: WURTH ELEKTRONIK; Manufacturer Part Number 1: 36003250; Enclosure Material: Tin Plate; External Height - Metric: 25; External Height - Imperial: 0.98"; Enclosure Type: Shielding Cabinet; External Depth - Metric: 3; External Depth - Imperial: 0.12"; Supplier 1: Farnell; Supplier: Farnell; RoHS: YES; IP Rating: -; External Width - Imperial: 0.98"; NEMA Rating: -; External Width - Metric: 25; Supplier Part Number 1: 1909662
R57 R59 R62 R69 R71 R74 R82 R84 = Res_0402: Manufacturer Part Number 1: RC0402JR-070RL; Manufacturer: Yageo; Part Description: RES SMD 0.0OHM JUMPER 1/16W 0402; Resistance (Ohms): 0.0; Tolerance: Jumper; Power (Watts): 0.063W, 1/16W; Value: 0R; Supplier 1: Digi-Key; Supplier Part Number 1: 311-0.0JRTR-ND; Category: Resistors; Temperature Coefficient: -; Features: Moisture Resistant; Supplier Device Package: 0402; Height: 0.016" (0.40mm); Package / Case: 0402 (1005 Metric); Operating Temperature: -55°C ~ 155°C; Size / Dimension: 0.039" L x 0.020" W (1.00mm x 0.50mm); Composition: Thick Film; Packaging: Tape & Reel (TR); Number of Terminations: 2; RoHS: RoHS Compliant
R58 R68 R76 R78 R80 = Res_0402: Manufacturer: Yageo; Manufacturer Part Number 1: RC0402FR-0710KL; Part Description: RES SMD 10K OHM 1% 1/16W 0402; Temperature Coefficient: ±100ppm/°C; Power (Watts): 0.063W, 1/16W; Value: 10k, 1%; Supplier 1: Digi-Key; Supplier Part Number 1: 311-10.0KLRTR-ND; Resistance (Ohms): 10k; Packaging: Tape & Reel (TR); RoHS: RoHS Compliant; Package / Case: 0402 (1005 Metric); Tolerance: ±1%; Operating Temperature: -55°C ~ 155°C; Size / Dimension: 0.039" L x 0.020" W (1.00mm x 0.50mm); Number of Terminations: 2; Category: Resistors; Height: 0.016" (0.40mm); Supplier Device Package: 0402; Features: Moisture Resistant; Composition: Thick Film
R60 = Res_0402: Part Description: RES SMD 22 OHM 1% 1/16W 0402; Manufacturer Part Number 1: RC0402FR-0722RL; Manufacturer: Yageo; Tolerance: ±1%; Temperature Coefficient: ±100ppm/°C; Resistance (Ohms): 22; Supplier 1: Digi-Key; Supplier Part Number 1: 311-22.0LRTR-ND; Supplier Device Package: 0402; Composition: Thick Film; Category: Resistors; Value: 22R
R61 R65 R77 R79 = Res_0402: Manufacturer: Yageo; Part Description: RES SMD 0.0OHM JUMPER 1/16W 0402; Manufacturer Part Number 1: RC0402JR-070RL; Supplier 1: Digi-Key; Supplier Part Number 1: 311-0.0JRTR-ND; Composition: Thick Film; Package / Case: 0402 (1005 Metric); Category: Resistors; Value: 0R
R63 = Res_0402: Manufacturer: Samsung Electro-Mechanics America, Inc.; Manufacturer Part Number: RC1005F49R9CS; Part Description: RES SMD 49.9 OHM 1% 1/16W 0402; Temperature Coefficient: ±100ppm/°C; Resistance (Ohms): 49.9; Power (Watts): 0.063W, 1/16W; Number of Terminations: 2; Size / Dimension: 0.039" L x 0.020" W (1.00mm x 0.50mm); Supplier Device Package: 0402 (1005 Metric); RoHS: RoHS Compliant; Supplier Part Number 1: 1276-3469-6-ND; Features: -; Packaging: Digi-Reel®; Tolerance: ±1%; Height: 0.016" (0.40mm); Category: Resistors; Composition: Thick Film; Package / Case: 0402 (1005 Metric); Supplier 1: Digi-Key; Operating Temperature: -55°C ~ 155°C; Value: 49.9R, 1%
R64 R66 = Res_0402: Manufacturer: Stackpole Electronics Inc; Manufacturer Part Number 1: RMCF0402FT1K00; Part Description: RES SMD 1K OHM 1% 1/16W 0402; Temperature Coefficient: ±100ppm/°C; Power (Watts): 0.063W, 1/16W; Value: 1k, 1%; Supplier 1: Digi-Key; Supplier Part Number 1: RMCF0402FT1K00TR-ND; Package / Case: 0402 (1005 Metric); Supplier Device Package: 0402; Height: 0.016" (0.40mm); Size / Dimension: 0.039" L x 0.020" W (1.00mm x 0.50mm); Number of Terminations: 2; Packaging: Cut Tape (CT); Category: Resistors; Composition: Thick Film; Resistance (Ohms): 1k; Tolerance: ±1%; Features: Moisture Resistant; Operating Temperature: -55°C ~ 155°C; RoHS: RoHS Compliant
R67 = Res_0402: Manufacturer: Vishay Dale; Part Description: RES SMD 3K OHM 1% 1/16W 0402; Manufacturer Part Number 1: CRCW04023K00FKED; Temperature Coefficient: ±100ppm/°C; Power (Watts): 0.063W, 1/16W; Value: 3k, 1%; Category: Resistors; Tolerance: ±1%; RoHS: RoHS Compliant; Composition: Thick Film; Number of Terminations: 2; Operating Temperature: -55°C ~ 155°C; Supplier Device Package: 0402 (1005 Metric); Supplier Part Number 1: 541-3.00KLCT-ND; Packaging: Cut Tape (CT); Supplier 1: Digi-Key; Package / Case: 0402 (1005 Metric); Features: Automotive AEC-Q200; Resistance (Ohms): 3k; Height: 0.016" (0.40mm); Size / Dimension: 0.039" L x 0.020" W (1.00mm x 0.50mm)
R70 R72 R73 R75 = Res_0402: Manufacturer Part Number 1: RMCF0402FT100R; Manufacturer: Stackpole Electronics Inc.; Part Description: RES SMD 100 OHM 1% 1/16W 0402; Power (Watts): 0.063W, 1/16W; Temperature Coefficient: ±100ppm/°C; Resistance (Ohms): 100; Value: 100R, 1%; Supplier 1: Digi-Key; Supplier Part Number 1: RMCF0402FT100RDKR-ND; Packaging: Digi-Reel®; Composition: Thick Film; Number of Terminations: 2; Package / Case: 0402 (1005 Metric); RoHS: RoHS Compliant; Category: Resistors; Size / Dimension: 0.039" L x 0.020" W (1.00mm x 0.50mm); Tolerance: ±1%; Supplier Device Package: 0402; Features: -; Height: 0.016" (0.40mm); Operating Temperature: -55°C ~ 155°C
R81 = Res_0402: Manufacturer: Yageo; Manufacturer Part Number 1: RC0402FR-074K7L; Part Description: ±1% 0.063W, 1/16W Chip Resistor 0402 (1005 Metric) Moisture Resistant Thick Film; Power (Watts): 0.063W, 1/16W; Temperature Coefficient: ±100ppm/°C; Supplier 1: Digi-Key; Supplier Part Number 1: 311-4.7KLRCT-ND; RoHS: RoHS Compliant; Category: Resistors; Stock 1: 4788231; Pricing 1: 1=0.1, 10=0.014, 100=0.0056, 1000=0.00253, 2500=0.0022, 5000=0.00181 (USD); Packaging: Cut Tape (CT); Part Status: Active; Tolerance: ±1%; Composition: Thick Film; Features: Moisture Resistant; Operating Temperature: -55°C ~ 155°C; Package / Case: 0402 (1005 Metric); Supplier Device Package: 0402; Size / Dimension: 0.039" L x 0.020" W (1.00mm x 0.50mm); Height - Seated (Max): 0.016" (0.40mm); Failure Rate: -; ComponentLink1URL: http://www.yageo.com/documents/recent/PYu-RC_Group_51_RoHS_L_7.pdf; ComponentLink1Description: http://www.yageo.com/documents/recent/PYu-RC_Group_51_RoHS_L_7.pdf; Value: 4K7, 1%
R83 = Res_0402: Manufacturer Part Number 1: RMCF0402FT3K83; Manufacturer: Stackpole Electronics Inc.; Part Description: RES SMD 3.83K OHM 1% 1/16W 0402; Temperature Coefficient: ±100ppm/°C; Power (Watts): 0.063W, 1/16W; Value: 3.83k, 1%; Height: 0.016" (0.40mm); Size / Dimension: 0.039" L x 0.020" W (1.00mm x 0.50mm); Number of Terminations: 2; Supplier Device Package: 0402; Package / Case: 0402 (1005 Metric); Features: Automotive AEC-Q200; Operating Temperature: -55°C ~ 155°C; Packaging: Cut Tape (CT); Supplier 1: Digi-Key; Supplier Part Number 1: RMCF0402FT3K83CT-ND; Composition: Thick Film; Tolerance: ±1%; Category: Resistors; Resistance (Ohms): 3.83k; RoHS: RoHS Compliant
R85 = Res_0402: Manufacturer Part Number 1: RC0402FR-07576RL; Manufacturer: Yageo; Part Description: RES SMD 576 OHM 1% 1/16W 0402; Temperature Coefficient: ±100ppm/°C; Power (Watts): 0.063W, 1/16W; Resistance (Ohms): 576; Size / Dimension: 0.039" L x 0.020" W (1.00mm x 0.50mm); Number of Terminations: 2; Height: 0.016" (0.40mm); Supplier Device Package: 0402; RoHS: RoHS Compliant; Supplier 1: Digi-Key; Supplier Part Number 1: YAG3189CT-ND; Tolerance: ±1%; Package / Case: 0402 (1005 Metric); Composition: Thick Film; Features: Moisture Resistant; Operating Temperature: -55°C ~ 155°C; Category: Resistors; Packaging: Cut Tape (CT); Value: 576R, 1%
VT4 = NDS331N: Part Description: MOSFET N-CH 20V 1.3A SSOT3; Manufacturer: FAIRCHILD SEMICONDUCTOR; Gate Charge (Qg) @ Vgs: 5nC @ 4.5V; Power - Max: 460mW; Current - Continuous Drain (Id) @ 25°C: 1.3A (Ta); Input Capacitance (Ciss) @ Vds: 162pF @ 10V; FET Type: MOSFET N-Channel, Metal Oxide; Drain to Source Voltage (Vdss): 20V; FET Feature: Logic Level Gate; Supplier Device Package: 3-SSOT; Category: Discrete Semiconductor Products; Mounting Type: Surface Mount; Package / Case: TO-236-3, SC-59, SOT-23-3; Supplier 1: Digi-Key; Supplier Part Number 1: NDS331NCT-ND; Manufacturer Part Number: NDS331N
XO1 = Rakon_RTX5032A: Part Description: RTX5032A 40MHz, High performance TCXO, With VC, Filter Enabled, 10-pin 5mm x 3.2 mm x 1.65 mm package; Manufacturer: Rakon; Manufacturer Part Number 1: RTX5032A; Supplier Part Number 1: RTX5032A; Supplier 1: RAKON

## Nets that join several sheets
GND: 05_LMS7002M_RF (41 pins), 06_LMS7002M_Power (82 pins), 08_USB3_0_device (40 pins), 09_Misc (71 pins)
VCC1P8_LMS: 05_LMS7002M_RF (13 pins), 06_LMS7002M_Power (11 pins), 09_Misc (C175.2 FR20.2)
VCC3P3: 05_LMS7002M_RF (R14.1 R20.1), 08_USB3_0_device (20 pins), 09_Misc (18 pins)
VCC5P0_USB: 05_LMS7002M_RF (R15.1 R21.1), 08_USB3_0_device (FR12.2), 09_Misc (11 pins)
VDIO_LMS: 06_LMS7002M_Power (5 pins), 09_Misc (C180.2 FR21.2)